# Altium schematic sheet 2008_SablierElectronique_Alim.SchDoc
size A4; Author: Carlos Reyes Peña; Organization: ETML-ES; Address1: Avenue Recordon 1; Address2: 1004 Lausanne; Address3: Switzerland; Revision: 1; SheetNumber: 4; SheetTotal: 4; Version: A
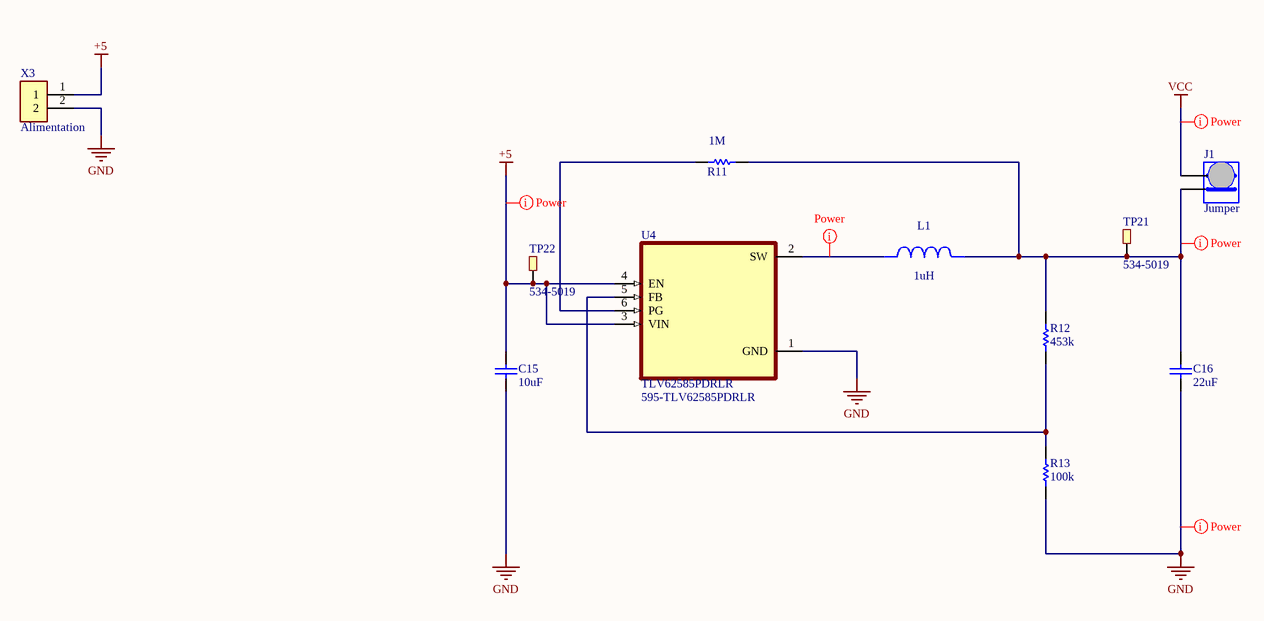
[diagram p0: 2008_SablierElectronique_Alim.SchDoc]

## Parts
C15  10uF  [RESC0805(2012)_L]
C16  22uF  [RESC0805(2012)_L]
J1  Jumper  [Jumper]
L1  value 1uH  [RESC0805(2012)_L]  (hidden comment: LQM21PN1R0MCHD0)
R11  1M  [RESC0805(2012)_L]
R12  453k  [RESC0805(2012)_L]
R13  100k  [RESC0805(2012)_L]
TP21  Supplier Part Number 1: 534-5019  [TESTPOINT_SMD]  (hidden comment: 5019)
TP22  Supplier Part Number 1: 534-5019  [TESTPOINT_SMD]  (hidden comment: 5019)
U4  TLV62585PDRLR  Supplier Part Number 1: 595-TLV62585PDRLR  [SOT563]
X3  Alimentation  [Header 2 pin]

## Nets
+5: C15.2 TP22.1 U4.3(VIN) U4.4(EN) X3.1
GND: C15.1 C16.1 R13.2 U4.1(GND) X3.2
VCC: J1.1
NetC16_2: C16.2 J1.2 L1.1 R11.1 R12.1 TP21.1
NetL1_2: L1.2 U4.2(SW)
NetR11_2: R11.2 U4.6(PG)
NetR12_2: R12.2 R13.1 U4.5(FB)

## Layout directives
net class Power: +5, GND, NetC16_2, NetL1_2, VCC

## Notes on the sheet
- Fichier :
- a
- Date :
- Heure :
- Version :
- Auteur :
- Modif.
- b
- c
- d
- Projet :
- No :
- Nb feuilles
- Feuille n°
- Chemin :

## Library data of the parts
C15 C16 = CAP1206
J1 = Jumper_2p
L1 = 744311100: LQM21PN1R0MCHD; PackageReference: LQM21PN1R0MCHD; Manufacturer Part Number: LQM21PN1R0MCHD; Supplier 1: Mouser; Supplier Part Number 1: 81-LQM21PN1R0MCHD
R11-R13 = RES
TP21 TP22 = TESTPOINT: Test point smd; Supplier 1: Mouser
U4 = TLV62585PDRLR: 2.5V-5.5V input, 3-A high efficiency step-down converter in 2x2 QFN or SOT563 package 6-SOT-5X3 -40 to 125; MF: Texas Instruments; Package: SOT-5X3-6 Texas Instruments; Availability: Good; Texas_Instruments-Purchase-URL: https://snapeda.com/shop?store=Texas+Instruments&id=3229753; MP: TLV62585PDRLR; Arrow_Electronics-Purchase-URL: https://snapeda.com/shop?store=Arrow+Electronics&id=3229753; SnapEDA_Link: https://www.snapeda.com/parts/TLV62585PDRLR/Texas%20Instruments/view-part/3229753/?ref=snap; Mouser-Purchase-URL: https://snapeda.com/shop?store=Mouser&id=3229753; Value: *; Price: None; Supplier 1: Mouser
X3 = Header 2 pin: Connector Header Through Hole 2 position; MF: TE Connectivity; MP: 826632-1; Mouser-Purchase-URL: https://snapeda.com/shop?store=Mouser&id=2390280; Package: None; Value: *; SnapEDA_Link: https://www.snapeda.com/parts/826632-1/TE%20Connectivity%20AMP%20Connectors/view-part/2390280/?ref=snap; Price: None; DigiKey-Purchase-URL: https://snapeda.com/shop?store=DigiKey&id=2390280; Availability: Unavailable; EU_RoHS_Compliance: Compliant